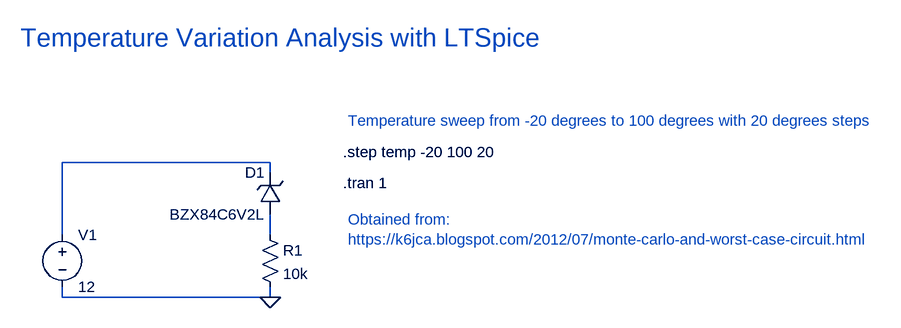
[diagram p0: schematic Temperature-Variation-LTSpice.asc]
Temperature-Variation-LTSpice.asc, the LTspice schematic file:
Version 4.1
SHEET 1 1200 680
WIRE 224 176 224 192
WIRE -96 176 -96 192
WIRE 224 192 -96 192
FLAG 224 192 0
WIRE 224 0 224 -16
WIRE -96 96 -96 80
WIRE 224 -16 -96 -16
WIRE -96 -16 -96 80
WIRE 224 64 224 80
WIRE 224 96 224 80
SYMBOL voltage -96 80 R0
WINDOW 123 0 0 Left 0
WINDOW 39 0 0 Left 0
SYMATTR InstName V1
SYMATTR Value 12
SYMBOL res 208 80 R0
SYMATTR InstName R1
SYMATTR Value 10k
SYMBOL zener 240 64 R180
WINDOW 0 24 64 Left 2
WINDOW 3 24 0 Left 2
SYMATTR InstName D1
SYMATTR Value BZX84C6V2L
SYMATTR Description Diode
SYMATTR Type diode
TEXT 336 -32 Left 2 !.step temp -20 100 20
TEXT 336 16 Left 2 !.tran 1
TEXT -160 -208 Left 4 ;Temperature Variation Analysis with LTSpice
TEXT 344 -80 Left 2 ;Temperature sweep from -20 degrees to 100 degrees with 20 degrees steps
TEXT 344 72 Left 2 ;Obtained from:\nhttps://k6jca.blogspot.com/2012/07/monte-carlo-and-worst-case-circuit.html

The netlist it stands for:
* Temperature-Variation-LTSpice.asc
V1 N001 0 12
R1 N002 0 10k
D1 N002 N001 BZX84C6V2L
.model D D
.lib standard.dio
.step temp -20 100 20
.tran 1
* Temperature Variation Analysis with LTSpice
* Temperature sweep from -20 degrees to 100 degrees with 20 degrees steps
* Obtained from:
* https://k6jca.blogspot.com/2012/07/monte-carlo-and-worst-case-circuit.html
.backanno
.end